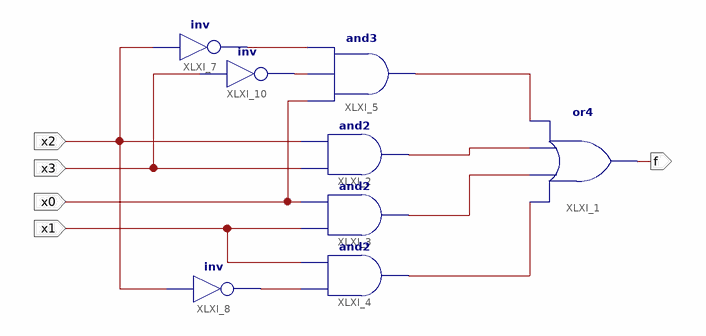
[diagram p0: schematic sheet 1]
// Xilinx ISE schematic ukol4.sch (spartan3) as structural Verilog: 8 symbols, 5 ports
module ukol4 (
  input  x3,
  input  x0,
  input  x1,
  input  x2,
  output f
);

  wire XLXN_1, XLXN_2, XLXN_3, XLXN_4, XLXN_11, XLXN_16, XLXN_19;

  or XLXI_1 (f, XLXN_4, XLXN_3, XLXN_2, XLXN_1);
  and XLXI_2 (XLXN_2, x3, x2);
  and XLXI_3 (XLXN_3, x1, x0);
  and XLXI_4 (XLXN_4, XLXN_16, x1);
  and XLXI_5 (XLXN_1, x0, XLXN_19, XLXN_11);
  not XLXI_7 (XLXN_11, x2);
  not XLXI_8 (XLXN_16, x2);
  not XLXI_10 (XLXN_19, x3);
endmodule
